# Altium project TPS563249DDCR Breakout.PrjPcb
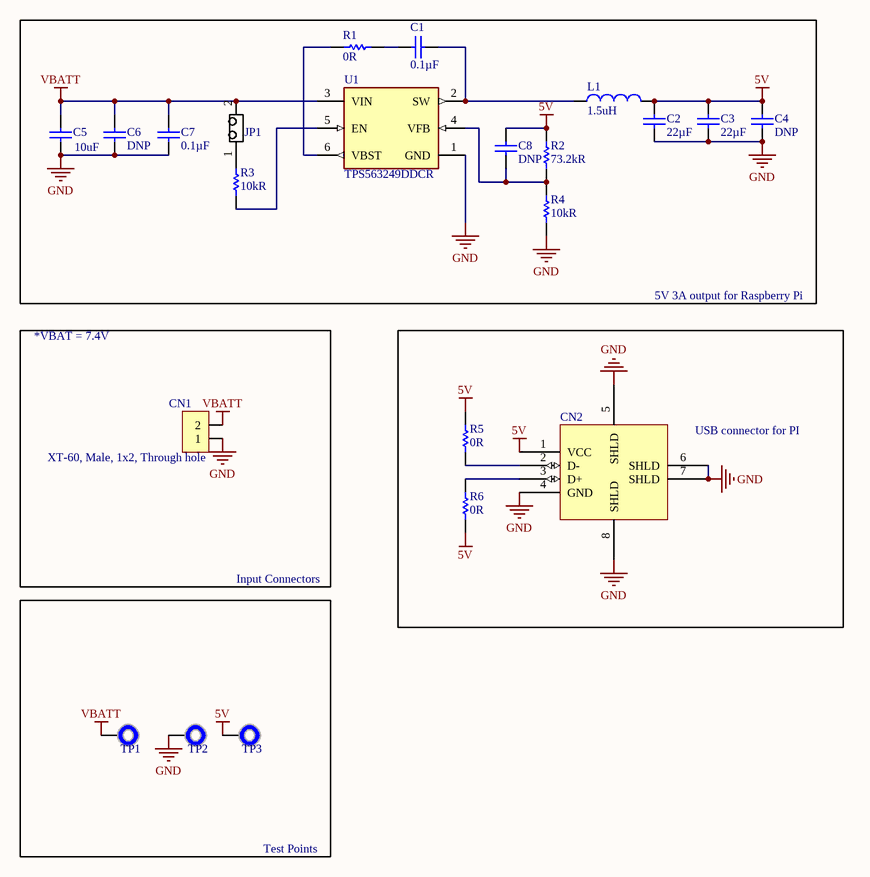
[diagram p0: Power.SchDoc]
1 sheet, 22 parts. Net scope: global (net labels, ports and power ports of the same name join across sheets).
Board file: TPS563249DDCR Breakout.PcbDoc

## Sheet Power.SchDoc
size A; SheetNumber: 1; SheetTotal: 1

### Parts
C1  Capacitance: 0.1µF  [CAPC1608N(0603")]  (hidden comment: 0.1uF, 50V, 10%, X7R, 0603)
C2  value 22µF  [CAPC2012N(0805")]  (hidden comment: 22uF 35V 0805 SMD, Ceramic)
C3  value 22µF  [CAPC2012N(0805")]  (hidden comment: 22uF 35V 0805 SMD, Ceramic)
C4  value DNP  [CAPC1608N(0603")]  (hidden comment: Placeholder_Capacitor_0603)
C5  Capacitance: 10uF  [CAPC2013X12N]  (hidden comment: 10uF, 25V, X5R, 0805)
C6  value DNP  [CAPC3216N(1206")]  (hidden comment: Placeholder_Capacitor_1206)
C7  Capacitance: 0.1µF  [CAPC1608N(0603")]  (hidden comment: 0.1uF, 50V, 10%, X7R, 0603)
C8  value DNP  [CAPC1608N(0603")]  (hidden comment: Placeholder_Capacitor_0603)
CN1  XT-60, Male, 1x2, Through hole  [XT-60 Male]  (no BOM)
CN2  USB - Type A Female  [USB - Type A Female-Footprint-1]  (value not drawn)
JP1  1x2 Male Header  [2X1 Males Header]  (value not drawn)
L1  Inductance: 1.5uH  [INDC2520X12N]  (hidden comment: DFE252012P-1R5M=P2)
R1  value 0R  [RESC1608N(0603")]  (hidden comment: 0R, 1%, 1/10W, 0603 SMD)
R2  Resistance: 73.2kR  [RESC1608X55X30LL15T15]  (hidden comment: ERJ-3EKF7322V)
R3  Resistance: 10kR  [RESC1608X55X25ML10T15]  (hidden comment: RC0603FR-0710KL)
R4  Resistance: 10kR  [RESC1608X55X25ML10T15]  (hidden comment: RC0603FR-0710KL)
R5  value 0R  [RESC1608N(0603")]  (hidden comment: 0R, 1%, 1/10W, 0603 SMD)
R6  value 0R  [RESC1608N(0603")]  (hidden comment: 0R, 1%, 1/10W, 0603 SMD)
TP1  Plated Hole, 1mm  [PLATED_HOLE_1mm]  (value not drawn)  (no BOM)
TP2  Plated Hole, 1mm  [PLATED_HOLE_1mm]  (value not drawn)  (no BOM)
TP3  Plated Hole, 1mm  [PLATED_HOLE_1mm]  (value not drawn)  (no BOM)
U1  TPS563249DDCR  [FP-DDC0005A-IPC_B]

### Blocks framed on the sheet
5V 3A output for Raspberry Pi: C1-C8 JP1 L1 R1-R4 U1
USB connector for PI: CN2 R5 R6

### Nets
5V: C2.2(Cathode) C3.2(Cathode) C4.2(Cathode) C8.1(Anode) CN2.1(VCC) L1.2 R2.2 R5.1 R6.2 TP3.1
GND: C2.1(Anode) C3.1(Anode) C4.1(Anode) C5.2 C6.1(Anode) C7.1(Anode) CN1.1 CN2.4(GND) CN2.5(SHLD) CN2.6(SHLD) CN2.7(SHLD) CN2.8(SHLD) R4.1 TP2.1 U1.1(GND)
VBATT: C5.1 C6.2(Cathode) C7.2(Cathode) CN1.2 JP1.2 TP1.1 U1.3(VIN)
NetC1_1: C1.1(Anode) L1.1 U1.2(SW)
NetC1_2: C1.2(Cathode) R1.2
NetC8_2: C8.2(Cathode) R2.1 R4.2 U1.4(VFB)
NetCN2_2: CN2.2(D-) R5.2
NetCN2_3: CN2.3(D+) R6.1
NetJP1_1: JP1.1 R3.2
NetR1_1: R1.1 U1.6(VBST)
NetR3_1: R3.1 U1.5(EN)

### Notes on the sheet
- *VBAT = 7.4V
- Input Connectors
- Test Points

### Library data of the parts
C1 C7 = CMP-006-0007-1: 0.1µF ±10% Ceramic Capacitor X7R 0603 (1608 Metric); Operating Temperature: -55°C ~ 125°C; Pin Count: 2; Design Item ID: 0.1uF, 50V, 10%, X7R, 0603; Package / Case: 0603 (1608 Metric); Source: AUVic_Schematic_Library_Capacitors.SchLib; ComponentLink1URL: https://www.digikey.ca/product-detail/en/tdk-corporation/C1608X7R1H104M080AA/445-5098-1-ND/2093713; ComponentLink1Description: Digi-Key; Mounting Type: Surface Mount, MLCC; Component Type: Standard; Created By: Poorna Chander Kalidas
C2 C3 = CMP-006-0036-1: Capacitor, Ceramic, 35V, +/- 20%, 0805 SMD, X5R; Design Item ID: 22uF 35V 0805 SMD, Ceramic; Source: AUVic_Schematic_Library_Capacitors.SchLib; Pin Count: 2; Component Type: Standard; Publisher: AUVic; PackageDescription: Chip Capacitor; Published: 14-06-01
C4 C8 = CMP-006-0054-1: Placeholder 0603 SMT Footprint; Made By: Ashwin Sira; Date Created: 2016-06-26; Design Item ID: Placeholder_Capacitor_0603; PackageDescription: Chip Capacitor; Component Type: Standard (No BOM); Pin Count: 2; Source: AUVic_Schematic_Library_Capacitors.SchLib; Publisher: AUVic
C5 = CMP-00114-1: 0805 10 uF 25 V ±10% Tolerance X5R SMT Multilayer Ceramic Capacitor; Dielectric: X7R; Max Operating Temperature: 85°C; Resistor Type: Ceramic; Lead Free: Lead Free; Tolerance: 10%; Height: 1.25mm; Package Quantity: 1; Voltage Rating: 25V; Width: 0.049inch; Min Operating Temperature: -55°C; Case Code (Imperial): 0805; Number of Pins: 2; Thickness: 0.053inch; Length: 0.079inch; Case Code (Metric): 2012; Mount: Surface Mount; Case/Package: 0805; Packaging: Tape and Reel; REACH SVHC: No SVHC; Termination: SMD/SMT; Voltage Rating (DC): 25V
C6 = CMP-006-0056-1: Placeholder 1206 SMT Footprint; Made By: Ashwin Sira; PackageDescription: Chip Capacitor; Component Type: Standard (No BOM); Source: AUVic_Schematic_Library_Capacitors.SchLib; Date Created: 2016-06-26; Design Item ID: Placeholder_Capacitor_1206; Pin Count: 2; Publisher: AUVic
CN1 = CMP-005-0041-1: Date Published: 2016-09-08; Pin Count: 2; Source: AUVic_Schematic_Library_Connectors.SchLib; Component Type: Standard (No BOM); Design Item ID: XT-60, Male, 1x2, Through hole; Publisher: Andy Bates
CN2 = CMP-00116-2: USB - Type A Female USB 2.0 THT; LCSC Part #: C168725; Created By: Miguel Manguerra
JP1 = CMP-004-0001-1: Made By: Andy Bates; Source: AUVic_Schematic_Library_Connectors.SchLib; Pin Count: 2; Design Item ID: 1x2 Male Header; Component Type: Standard
L1 = CMP-00112-1: Ind Metal Alloy Shielded 1.5uH 20% 1MHz Powdered Iron 2.6A 1008 T/R; Core Material: Ferrite; Current Rating: 3.5A; DC Resistance (DCR): 60mR; Packaging: Tape and Reel; Mount: Surface Mount; Depth: 2mm; Tolerance: 20%; Shielding: Shielded; Test Frequency: 1MHz; Width: 0.079inch; Case Code (Metric): 2520; Min Operating Temperature: -40°C; Resistor Type: Wirewound,Metal Alloy; Length: 0.098inch; Case/Package: 1008; Case Code (Imperial): 1008; Height - Seated (Max): 0.039inch; Max Operating Temperature: 125°C; Max DC Current: 2.6A
R1 R5 R6 = CMP-047-0001-1: Made By: Ashwin Sira; Owned By: AUVic; Component Type: Standard; Design Item ID: 0R, 1%, 1/10W, 0603 SMD; Last Edited: 14-05-31; Created On: 14-05-31; Source: AUVic_Schematic_Library_Resistors.SchLib; Pin Count: 2
R2 = CMP-00029-1: Res Thick Film 0603 73.2K Ohm 1% 0.1W(1/10W) ±100ppm/C Pad SMD Automotive T/R; Max Power Dissipation: 100mW; Voltage Rating (DC): 50V; Temperature Coefficient: 100ppm/°C; Voltage Rating: 75V; Packaging: Tape and Reel; REACH SVHC: No SVHC; Case Code (Imperial): 0603; Mount: Surface Mount; Height: 0.022inch; Military Standard: Not; Features: Automotive AEC-Q200; Power Rating: 100mW; Width: 0.031inch; Termination: SMD/SMT; Number of Terminations: 2; Composition: Thick Film; Length: 1.6mm; Depth: 0.8mm; Min Operating Temperature: -55°C; Package Quantity: 1; Max Operating Temperature: 155°C; Case/Package: 0603; Case Code (Metric): 1608; Tolerance: 1%; Radiation Hardening: No; Contact Plating: Tin; Lead Free: Lead Free
R3 R4 = CMP-00037-1: Res General Purpose Thick Film 0603 10K Ohm 1% 1/10W ±100ppm/°C Molded SMD Paper T/R; Power Rating: 100mW; Voltage Rating (DC): 50V; Voltage Rating: 75V; Case/Package: 0603; Weight: 7.1E-05oz; Case Code (Imperial): 0603; Composition: Thick Film; Depth: 0.8mm; Min Operating Temperature: -55°C; Width: 0.8mm; Height: 0.45mm; Military Standard: Not; Packaging: Tape and Reel; Termination: SMD/SMT; Lead Free: Lead Free; Temperature Coefficient: 100ppm/°C; Number of Pins: 2; Max Operating Temperature: 155°C; Lead Pitch: 0.3mm; REACH SVHC: No SVHC; Case Code (Metric): 1608; Tolerance: 1%; Length: 1.6mm
TP1-TP3 = CMP-054-0000-1: Created By: Ashwin Sira; Design Item ID: Plated Hole, 1mm; Source: AUVic_Integrated_Library_Virtual_Components.SchLib; Publisher: AUVic; Pin Count: 1; Date Created: 2016-07-10; Component Type: Standard (No BOM)
U1 = CMP-044-0004-1: 17-V, 3-A, constant 1.4-MHz synchronous step-down voltage regulator 6-SOT-23-THIN -40 to 125